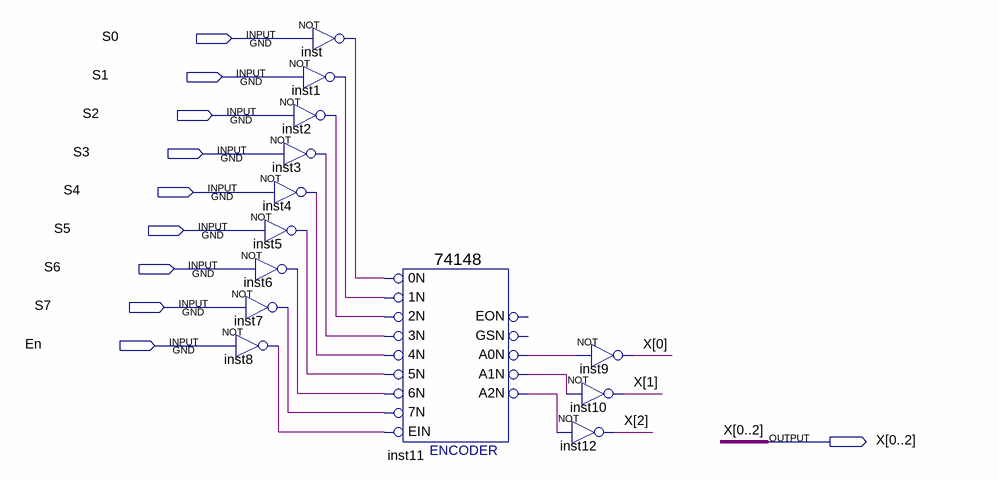
[diagram p0: schematic sheet]
// Quartus schematic ecd8.bdf as structural Verilog: 13 symbols, 10 pins
module ecd8 (
  input  S0,
  input  S1,
  input  S2,
  input  S3,
  input  S4,
  input  S5,
  input  S6,
  input  S7,
  input  En,
  output [0:2] X
);

  wire inst1_out, inst2_out, inst3_out, inst4_out, inst5_out, inst6_out, inst7_out, inst8_out, inst11_a0n,
       inst11_a1n, inst11_a2n, inst_out;

  not inst6 (inst6_out, S6);
  not inst7 (inst7_out, S7);
  not inst8 (inst8_out, En);
  not inst (inst_out, S0);
  not inst1 (inst1_out, S1);
  not inst2 (inst2_out, S2);
  not inst3 (inst3_out, S3);
  not inst4 (inst4_out, S4);
  not inst5 (inst5_out, S5);
  \74148  inst11 (
    .\5N (inst5_out), .\0N (inst_out), .\1N (inst1_out), .\2N (inst2_out), .\3N (inst3_out),
    .\4N (inst4_out), .EIN(inst8_out), .\6N (inst6_out), .\7N (inst7_out), .A1N(inst11_a1n),
    .A0N(inst11_a0n), .A2N(inst11_a2n));  // open: EON, GSN
  not inst9 (X[0], inst11_a0n);
  not inst10 (X[1], inst11_a1n);
  not inst12 (X[2], inst11_a2n);
endmodule
